# Altium schematic sheet 24V_to_5V_Buck.SchDoc
size 279 x 215 mm
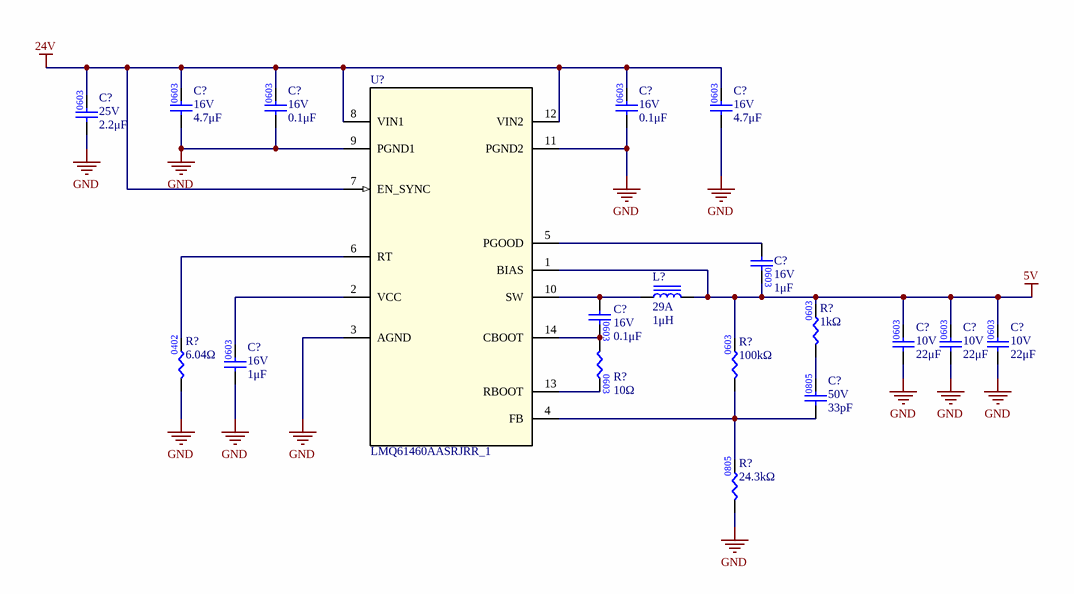
[diagram p0: 24V_to_5V_Buck.SchDoc]

## Parts
(Parts that share a designator on the sheet are numbered #1, #2 ... from top to bottom, then left to right.)
C?#1  value 4.7μF  Voltage Rating: 16V  [CAP0603]  (hidden comment: CAP_4.7uF_16V_0603)
C?#2  value 0.1μF  Voltage Rating: 16V  [CAP0603]  (hidden comment: CAP_0.1uF_16V_0603)
C?#3  value 0.1μF  Voltage Rating: 16V  [CAP0603]  (hidden comment: CAP_0.1uF_16V_0603)
C?#4  value 4.7μF  Voltage Rating: 16V  [CAP0603]  (hidden comment: CAP_4.7uF_16V_0603)
C?#5  value 2.2μF  Voltage Rating: 25V  [CAP0603]  (hidden comment: CAP_2.2uF_25V_0603)
C?#6  value 1μF  Voltage Rating: 16V  [CAP0603]  (hidden comment: CAP_1uF_16V_0603)
C?#7  value 0.1μF  Voltage Rating: 16V  [CAP0603]  (hidden comment: CAP_0.1uF_16V_0603)
C?#8  value 22μF  Voltage Rating: 10V  [CAP0603]  (hidden comment: CAP_22uF_10V_0603)
C?#9  value 22μF  Voltage Rating: 10V  [CAP0603]  (hidden comment: CAP_22uF_10V_0603)
C?#10  value 22μF  Voltage Rating: 10V  [CAP0603]  (hidden comment: CAP_22uF_10V_0603)
C?#11  value 1μF  Voltage Rating: 16V  [CAP0603]  (hidden comment: CAP_1uF_16V_0603)
C?#12  value 33pF  Voltage Rating: 50V  [CAP0805]  (hidden comment: CAP_33pF_50V_0805)
L?  Current Rating: 29A  Inductance: 1μH  [IND_BOURNS_SRP1250]  (hidden comment: IND_1uH_29A)
R?#1  value 10Ω  [RES0603]  (hidden comment: RES_10Ω_0603_1%)
R?#2  value 1kΩ  [RES0603]  (hidden comment: RES_1kΩ_0603_5%)
R?#3  value 6.04Ω  [RES0402]  (hidden comment: RES_6.04Ω_0402_1%)
R?#4  value 100kΩ  [RES0603]  (hidden comment: RES_100kΩ_0603_1%)
R?#5  value 24.3kΩ  [RES0805]  (hidden comment: RES_24.3kΩ_0805_1%)
U?  LMQ61460AASRJRR_1  [RJR0014A-MFG]

## Nets
5V: C?#6.2 C?#8.2 C?#9.2 C?#10.2 L?.2 R?#2.2 R?#4.2 U?.1(BIAS)
24V: C?#1.2 C?#2.2 C?#3.2 C?#4.2 C?#5.2 U?.7(EN_SYNC) U?.8(VIN1) U?.12(VIN2)
GND: C?#1.1 C?#2.1 C?#3.1 C?#4.1 C?#5.1 C?#8.1 C?#9.1 C?#10.1 C?#11.1 R?#3.1 R?#5.1 U?.3(AGND) U?.9(PGND1) U?.11(PGND2)
NetC?#6_1: C?#6.1 U?.5(PGOOD)
NetC?#7_1: C?#7.1 L?.1 U?.10(SW)
NetC?#7_2: C?#7.2 R?#1.1 U?.14(CBOOT)
NetC?#11_2: C?#11.2 U?.2(VCC)
NetC?#12_1: C?#12.1 R?#4.1 R?#5.2 U?.4(FB)
NetC?#12_2: C?#12.2 R?#2.1
NetR?#1_2: R?#1.2 U?.13(RBOOT)
NetR?#3_2: R?#3.2 U?.6(RT)

## Notes on the sheet
- University of Waterloo Robotics Team
- 200 University Ave W
- REV
- PROJECT
- Waterloo, Ontario, Canada
- N2L 3G1
- DOCUMENT
- ENGINEER
- REVIEWER
- MODIFIED
- SHEET
- OF
- (in symbol CAP_2.2uF_25V_0603) 0603
- (in symbol RES_10Ω_0603_1%) 0603
- (in symbol RES_100kΩ_0603_1%) 0603

## Library data of the parts
C?#1 C?#4 = CAP_4.7uF_16V_0603: CAP CER 4.7UF 16V X6S 0603; Manufacturer Part Number 1: GRM188C81C475KE11D; Manufacturer 1: Murata Electronics; Supplier Part Number 1: 490-13362-1-ND; Supplier 1: Digi-Key; Mounting Type: SMD; Package: 0603; Dielectric: X6S
C?#2 C?#3 C?#7 = CAP_0.1uF_16V_0603: CAP CER 0.1UF 16V X7R 0603; Manufacturer Part Number 1: CC0603KRX7R7BB104; Manufacturer 1: Yageo; Package: 0603; Supplier Part Number 1: 311-1088-1-ND; Supplier 1: Digi-Key; Dielectric: X7R
C?#5 = CAP_2.2uF_25V_0603: CAP CER 2.2UF 25V X5R 0603; Manufacturer Part Number 1: C1608X5R1E225K080AB; Manufacturer 1: TDK Corporation; Dielectric: 5; Supplier Part Number 1: 445-5964-1-ND; Supplier 1: Digi-Key
C?#6 C?#11 = CAP_1uF_16V_0603: CAP CER 1UF 16V Y5V 0603; Manufacturer 1: Yageo; Manufacturer Part Number 1: CC0603ZRY5V7BB105; Supplier Part Number 1: 311-1372-1-ND; Supplier 1: Digi-Key; Mounting Type: SMD; Package: 0603; Dielectric: Y5V
C?#8-C?#10 = CAP_22uF_10V_0603: CAP CER 22UF 10V X5R 0603; Manufacturer: Taiyo Yuden; Manufacturer Part Number: LMK107BBJ226MA-T; Supplier 1: Digi-Key; Supplier Part Number 1: 587-4913-1-ND; Package: 0603
C?#12 = CAP_33pF_50V_0805: CAP CER 33PF 50V C0G/NP0 0805; Manufacturer 1: Samsung Electro-Mechanics; Manufacturer Part Number 1: CL21C330JBANNNC; Dielectric: C0G/NP0; Mounting Type: SMD; Supplier 1: Digi-Key; Supplier Part Number 1: 1276-1105-1-ND; Package: 0805
L? = IND_1uH_29A: INDUCTOR 1UH 29A 2.5 MOHM SMD; Manufacturer 1: Bourns Inc.; Manufacturer Part Number 1: SRP1250-1R0M; Inductance Tolerance: 20%; Saturation Current: 50A; Test Frequency: 100kHz; DC Resistance (DCR): 2.5mOhm; Mounting Type: SMD; Supplier 1: Digi-Key; Supplier Part Number 1: SRP1250-1R0MCT-ND
R?#1 = RES_10Ω_0603_1%: RES 10 OHM 1% 1/10W 0603; Manufacturer 1: Vishay Dale; Manufacturer Part Number 1: CRCW060310R0FKEA; Supplier Part Number 1: 541-10.0HCT-ND; Supplier 1: Digi-Key
R?#2 = RES_1kΩ_0603_5%: RES 1K OHM 5% 1/10W 0603; Manufacturer 1: Yageo; Manufacturer Part Number 1: RC0603JR-071KL; Supplier Part Number 1: 311-1.0KGRCT-ND; Supplier 1: Digi-Key; Mounting Type: SMD; Package: 0603
R?#3 = RES_6.04Ω_0402_1%: RES 6.04 OHM 1% 1/16W 0402; Manufacturer Part Number 1: RMCF0402FT6R04; Manufacturer 1: Stackpole Electronics Inc; Power: 0.063W, 1/16W; Supplier 1: Digi-Key; Supplier Part Number 1: RMCF0402FT6R04CT-ND; Mounting Type: SMD; Package: 0402; Tolerance: 1%
R?#4 = RES_100kΩ_0603_1%: RES 100K OHM 1% 1/10W 0603; Manufacturer 1: Yageo; Manufacturer Part Number 1: RC0603FR-07100KL; Supplier Part Number 1: 311-100KHRCT-ND; Supplier 1: Digi-Key
R?#5 = RES_24.3kΩ_0805_1%: RES 24.3K OHM 1% 1/8W 0805; Manufacturer 1: YAGEO; Manufacturer Part Number 1: RC0805FR-0724K3L; Power: 0.125W; Package: 0805; Tolerance: 1%; Supplier 1: Future Electronics
U? = LMQ61460AASRJRR_1: No Description Available; Mfr_Name: Texas Instruments; TYPE: TYPE; RefDes: RefDes